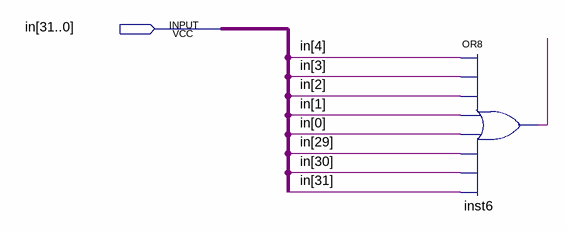
[diagram p0: schematic sheet]
// Quartus schematic nor5.bdf as structural Verilog: 1 symbols, 1 pins
module nor5 (
  input  [31:0] in
);

  wire inst6_out;

  or inst6 (inst6_out, in[4], in[3], in[2], in[1], in[0], in[29], in[30], in[31]);
endmodule
